# Altium project ReactionWheelPCB.PrjPcb
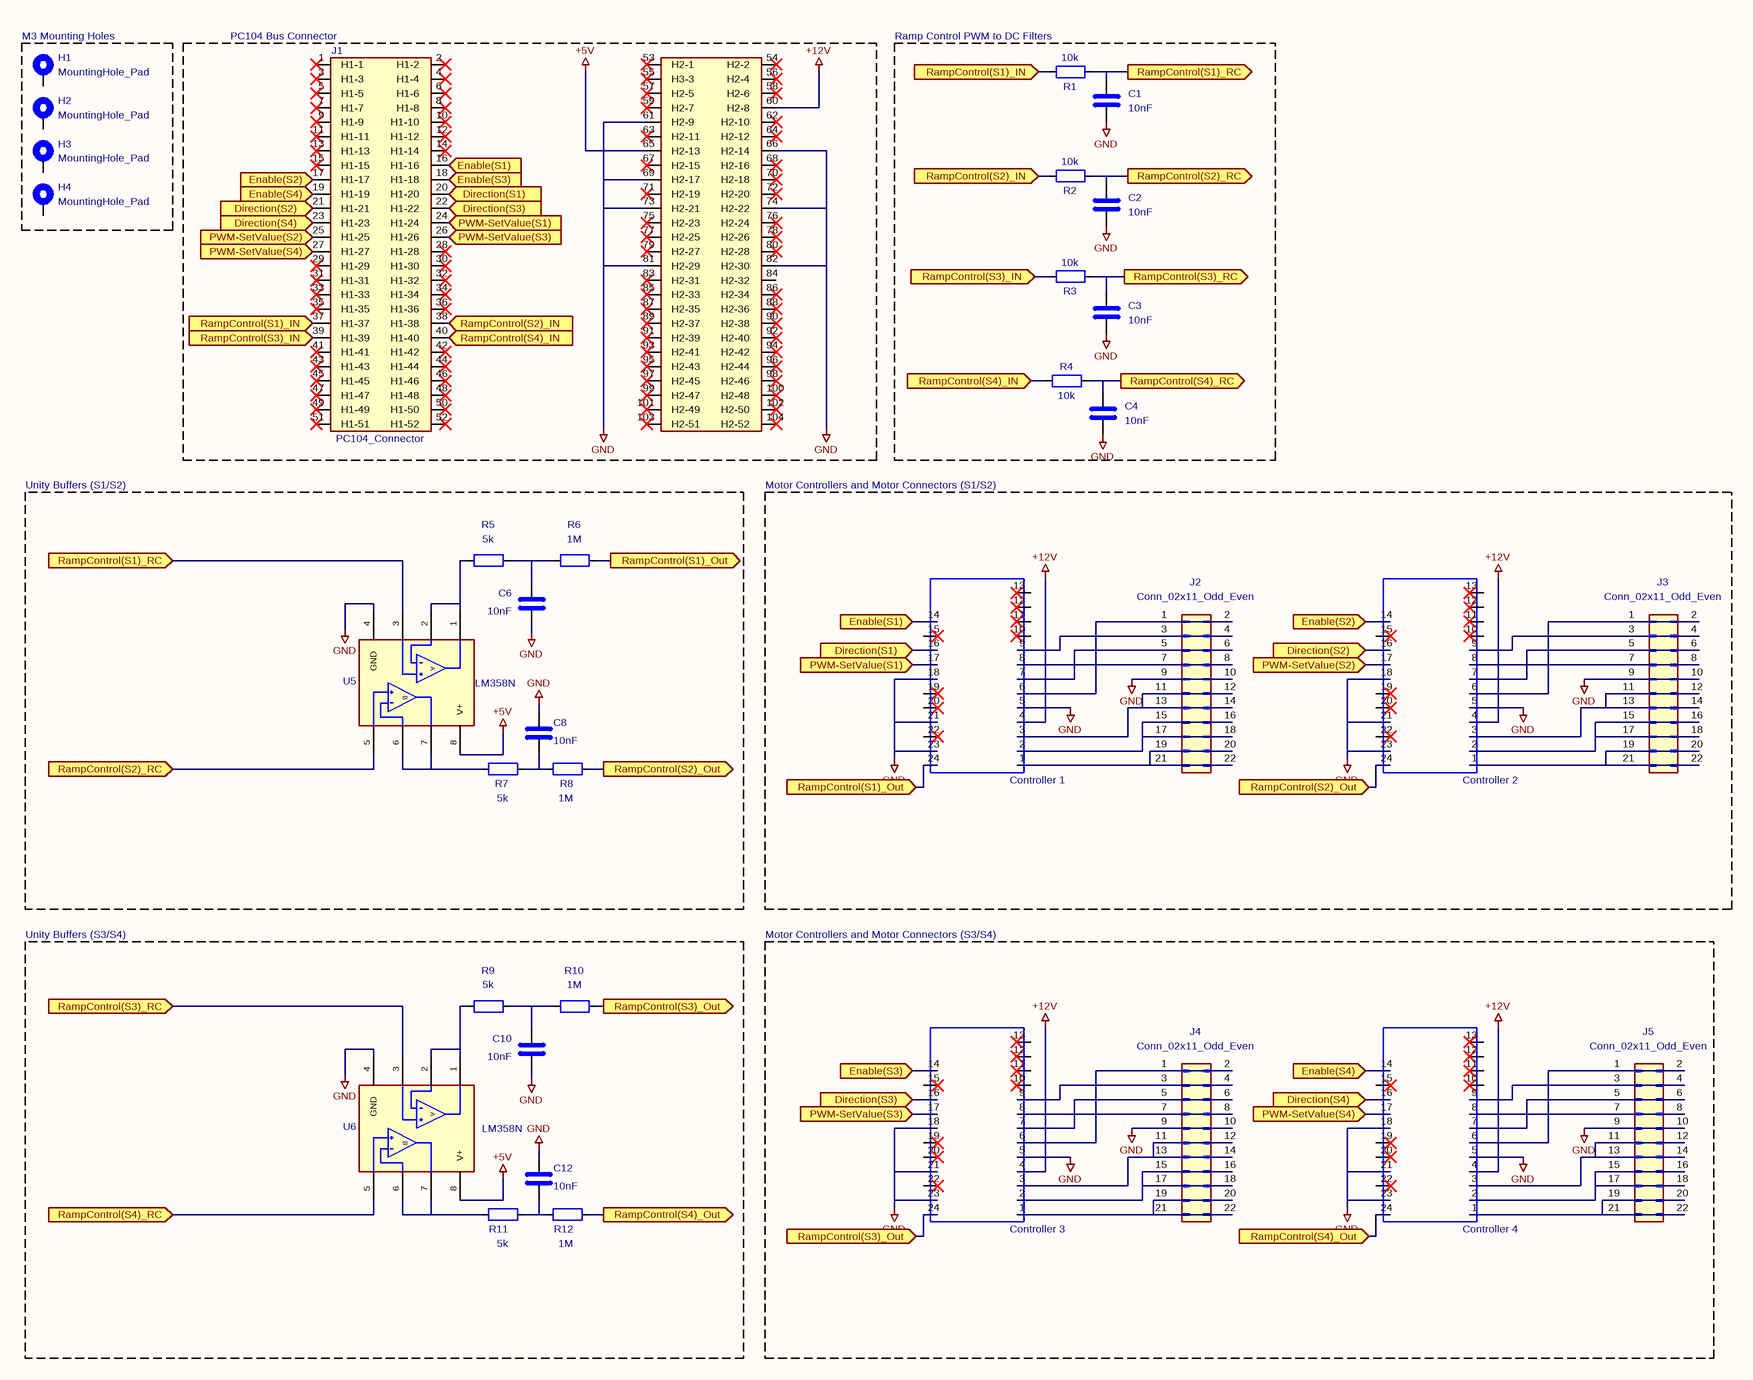
[diagram p0: ReactionWheelPCB.SchDoc]
1 sheet, 35 parts. Net scope: flat (ports and power ports of the same name join across sheets).
Board files: ReactionWheelPCB.PcbDoc, ReactionWheelPCB(1).PcbDoc

## Sheet ReactionWheelPCB.SchDoc
size 420 x 297 mm

### Parts
C1  10nF  [C_0603_1608Metric]
C2  10nF  [C_0603_1608Metric]
C3  10nF  [C_0603_1608Metric]
C4  10nF  [C_0603_1608Metric]
C6  10nF  [C_0603_1608Metric]
C8  10nF  [C_0603_1608Metric]
C10  10nF  [C_0603_1608Metric]
C12  10nF  [C_0603_1608Metric]
H1  MountingHole_Pad  [MountingHole_3.2mm_M3_Pad_TopBottom]
H2  MountingHole_Pad  [MountingHole_3.2mm_M3_Pad_TopBottom]
H3  MountingHole_Pad  [MountingHole_3.2mm_M3_Pad_TopBottom]
H4  MountingHole_Pad  [MountingHole_3.2mm_M3_Pad_TopBottom]
J1  PC104_Connector  [pc104-connector]
J2  Conn_02x11_Odd_Even  [1-1734248-1-reaction-wheel-connector]
J3  Conn_02x11_Odd_Even  [1-1734248-1-reaction-wheel-connector]
J4  Conn_02x11_Odd_Even  [1-1734248-1-reaction-wheel-connector]
J5  Conn_02x11_Odd_Even  [1-1734248-1-reaction-wheel-connector]
R1  10k  [R_0603_1608Metric]
R2  10k  [R_0603_1608Metric]
R3  10k  [R_0603_1608Metric]
R4  10k  [R_0603_1608Metric]
R5  5k  [R_0603_1608Metric]
R6  1M  [R_0603_1608Metric]
R7  5k  [R_0603_1608Metric]
R8  1M  [R_0603_1608Metric]
R9  5k  [R_0603_1608Metric]
R10  1M  [R_0603_1608Metric]
R11  5k  [R_0603_1608Metric]
R12  1M  [R_0603_1608Metric]
U1  Controller 1  [Escon24.2]
U2  Controller 2  [Escon24.2]
U3  Controller 3  [Escon24.2]
U4  Controller 4  [Escon24.2]
U5  LM358N  [DIP794W45P254L959H508Q8]
U6  LM358N  [DIP794W45P254L959H508Q8]

### Blocks framed on the sheet
M3 Mounting Holes /: H1-H4
PC104 Bus Connector: J1
Ramp Control PWM to DC Filters: C1-C4 R1-R4
Motor Controllers and Motor Connectors (S1/S2) /: J2 J3 U1 U2
Motor Controllers and Motor Connectors (S3/S4) /: J4 J5 U3 U4

### Ports
Direction(S1) (in), Direction(S2) (in), Direction(S3) (in), Direction(S4) (in), Enable(S1) (in), Enable(S2) (in), Enable(S3) (in), Enable(S4) (in), PWM-SetValue(S1) (in), PWM-SetValue(S2) (in), PWM-SetValue(S3) (in), PWM-SetValue(S4) (in), RampControl(S1)_IN (in), RampControl(S1)_Out (in), RampControl(S1)_Out (out), RampControl(S1)_RC (in), RampControl(S1)_RC (out), RampControl(S2)_IN (in), RampControl(S2)_Out (in), RampControl(S2)_Out (out), RampControl(S2)_RC (in), RampControl(S2)_RC (out), RampControl(S3)_IN (in), RampControl(S3)_Out (in), RampControl(S3)_Out (out), RampControl(S3)_RC (in), RampControl(S3)_RC (out), RampControl(S4)_IN (in), RampControl(S4)_Out (in), RampControl(S4)_Out (out), RampControl(S4)_RC (in), RampControl(S4)_RC (out)

### Nets
+5V: J1.65(H2-13) U5.8(V+) U6.8(V+)
+12V: J1.60(H2-8) U1.4 U2.4 U3.4 U4.4
GND: C1.1 C2.1 C3.1 C4.1 C6.1 C8.1 C10.1 C12.1 J1.61(H2-9) J1.66(H2-14) J1.69(H2-17) J1.73(H2-21) J1.74(H2-22) J1.81(H2-29) J1.82(H2-30) J2.9(Pin_9) J2.10(Pin_10) J3.9(Pin_9) J3.10(Pin_10) J4.9(Pin_9) J4.10(Pin_10) J5.9(Pin_9) J5.10(Pin_10) U1.5 U1.18 U1.21 U1.23 U2.5 U2.18 U2.21 U2.23 U3.5 U3.18 U3.21 U3.23 U4.5 U4.18 U4.21 U4.23 U5.4(GND) U6.4(GND)
Direction(S1): J1.20(H1-20) U1.16 ; port Direction(S1)
Direction(S2): J1.21(H1-21) U2.16 ; port Direction(S2)
Direction(S3): J1.22(H1-22) U3.16 ; port Direction(S3)
Direction(S4): J1.23(H1-23) U4.16 ; port Direction(S4)
Enable(S1): J1.16(H1-16) U1.14 ; port Enable(S1)
Enable(S2): J1.17(H1-17) U2.14 ; port Enable(S2)
Enable(S3): J1.18(H1-18) U3.14 ; port Enable(S3)
Enable(S4): J1.19(H1-19) U4.14 ; port Enable(S4)
PWM-SetValue(S1): J1.24(H1-24) U1.17 ; port PWM-SetValue(S1)
PWM-SetValue(S2): J1.25(H1-25) U2.17 ; port PWM-SetValue(S2)
PWM-SetValue(S3): J1.26(H1-26) U3.17 ; port PWM-SetValue(S3)
PWM-SetValue(S4): J1.27(H1-27) U4.17 ; port PWM-SetValue(S4)
RampControl(S1)_IN: J1.37(H1-37) R1.1 ; port RampControl(S1)_IN
RampControl(S1)_Out: R6.1 U1.24 ; port RampControl(S1)_Out
RampControl(S1)_RC: C1.2 R1.2 U5.3 ; port RampControl(S1)_RC
RampControl(S2)_IN: J1.38(H1-38) R2.1 ; port RampControl(S2)_IN
RampControl(S2)_Out: R8.2 U2.24 ; port RampControl(S2)_Out
RampControl(S2)_RC: C2.2 R2.2 U5.5 ; port RampControl(S2)_RC
RampControl(S3)_IN: J1.39(H1-39) R3.1 ; port RampControl(S3)_IN
RampControl(S3)_Out: R10.1 U3.24 ; port RampControl(S3)_Out
RampControl(S3)_RC: C3.2 R3.2 U6.3 ; port RampControl(S3)_RC
RampControl(S4)_IN: J1.40(H1-40) R4.1 ; port RampControl(S4)_IN
RampControl(S4)_Out: R12.2 U4.24 ; port RampControl(S4)_Out
RampControl(S4)_RC: C4.2 R4.2 U6.5 ; port RampControl(S4)_RC
NetC6_2: C6.2 R5.1 R6.2
NetC8_2: C8.2 R7.2 R8.1
NetC10_2: C10.2 R9.1 R10.2
NetC12_2: C12.2 R11.2 R12.1
NetJ2_1: J2.1(Pin_1) J2.2(Pin_2) U1.6
NetJ2_3: J2.3(Pin_3) J2.4(Pin_4) U1.9
NetJ2_5: J2.5(Pin_5) J2.6(Pin_6) U1.7
NetJ2_7: J2.7(Pin_7) J2.8(Pin_8) U1.8
NetJ2_11: J2.11(Pin_11) J2.12(Pin_12) J2.13(Pin_13) J2.14(Pin_14) U1.3
NetJ2_15: J2.15(Pin_15) J2.16(Pin_16) J2.17(Pin_17) J2.18(Pin_18) U1.2
NetJ2_19: J2.19(Pin_19) J2.20(Pin_20) J2.21(Pin_21) J2.22(Pin_22) U1.1
NetJ3_1: J3.1(Pin_1) J3.2(Pin_2) U2.6
NetJ3_3: J3.3(Pin_3) J3.4(Pin_4) U2.9
NetJ3_5: J3.5(Pin_5) J3.6(Pin_6) U2.7
NetJ3_7: J3.7(Pin_7) J3.8(Pin_8) U2.8
NetJ3_11: J3.11(Pin_11) J3.12(Pin_12) J3.13(Pin_13) J3.14(Pin_14) U2.3
NetJ3_15: J3.15(Pin_15) J3.16(Pin_16) J3.17(Pin_17) J3.18(Pin_18) U2.2
NetJ3_19: J3.19(Pin_19) J3.20(Pin_20) J3.21(Pin_21) J3.22(Pin_22) U2.1
NetJ4_1: J4.1(Pin_1) J4.2(Pin_2) U3.6
NetJ4_3: J4.3(Pin_3) J4.4(Pin_4) U3.9
NetJ4_5: J4.5(Pin_5) J4.6(Pin_6) U3.7
NetJ4_7: J4.7(Pin_7) J4.8(Pin_8) U3.8
NetJ4_11: J4.11(Pin_11) J4.12(Pin_12) J4.13(Pin_13) J4.14(Pin_14) U3.3
NetJ4_15: J4.15(Pin_15) J4.16(Pin_16) J4.17(Pin_17) J4.18(Pin_18) U3.2
NetJ4_19: J4.19(Pin_19) J4.20(Pin_20) J4.21(Pin_21) J4.22(Pin_22) U3.1
NetJ5_1: J5.1(Pin_1) J5.2(Pin_2) U4.6
NetJ5_3: J5.3(Pin_3) J5.4(Pin_4) U4.9
NetJ5_5: J5.5(Pin_5) J5.6(Pin_6) U4.7
NetJ5_7: J5.7(Pin_7) J5.8(Pin_8) U4.8
NetJ5_11: J5.11(Pin_11) J5.12(Pin_12) J5.13(Pin_13) J5.14(Pin_14) U4.3
NetJ5_15: J5.15(Pin_15) J5.16(Pin_16) J5.17(Pin_17) J5.18(Pin_18) U4.2
NetJ5_19: J5.19(Pin_19) J5.20(Pin_20) J5.21(Pin_21) J5.22(Pin_22) U4.1
NetR5_2: R5.2 U5.1 U5.2
NetR7_1: R7.1 U5.6 U5.7
NetR9_2: R9.2 U6.1 U6.2
NetR11_1: R11.1 U6.6 U6.7

Not connected (* = marked no-connect by the designer): H1 1; H2 1; H3 1; H4 1; J1 1(H1-1)* 2(H1-2)* 3(H1-3)* 4(H1-4)* 5(H1-5)* 6(H1-6)* 7(H1-7)* 8(H1-8)* 9(H1-9)* 10(H1-10)* 11(H1-11)* 12(H1-12)* 13(H1-13)* 14(H1-14)* 15(H1-15)* 28(H1-28)* 29(H1-29)* 30(H1-30)* 31(H1-31)* 32(H1-32)* 33(H1-33)* 34(H1-34)* 35(H1-35)* 36(H1-36)* 41(H1-41)* 42(H1-42)* 43(H1-43)* 44(H1-44)* 45(H1-45)* 46(H1-46)* 47(H1-47)* 48(H1-48)* 49(H1-49)* 50(H1-50)* 51(H1-51)* 52(H1-52)* 53(H2-1)* 54(H2-2)* 55(H3-3)* 56(H2-4)* 57(H2-5)* 58(H2-6)* 59(H2-7)* 62(H2-10)* 63(H2-11)* 64(H2-12)* 67(H2-15)* 68(H2-16)* 70(H2-18)* 71(H2-19)* 72(H2-20)* 75(H2-23)* 76(H2-24)* 77(H2-25)* 78(H2-26)* 79(H2-27)* 80(H2-28)* 83(H2-31)* 84(H2-32) 85(H2-33)* 86(H2-34)* 87(H2-35)* 88(H2-36)* 89(H2-37)* 90(H2-38)* 91(H2-39)* 92(H2-40)* 93(H2-41)* 94(H2-42)* 95(H2-43)* 96(H2-44)* 97(H2-45)* 98(H2-46)* 99(H2-47)* 100(H2-48)* 101(H2-49)* 102(H2-50)* 103(H2-51)* 104(H2-52)*; U1 10* 11* 12* 13* 15* 19* 20* 22*; U2 10* 11* 12* 13* 15* 19* 20* 22*; U3 10* 11* 12* 13* 15* 19* 20* 22*; U4 10* 11* 12* 13* 15* 19* 20* 22*

### Notes on the sheet
- Unity Buffers (S1/S2)
- Unity Buffers (S3/S4)
- 1
- 2
- 3
- 4
- 5
- 6
- 7
- 8
- A
- B
- C
- D
- E
- Title:
- File: ReactionWheelPCB.kicad_sch
- Sheet: /
- F
- KiCad E.D.A.  kicad (5.1.4)-1
- Size: A3
- Date:
- Rev:
- Id: 1/1
- (in symbol LM358) A; B

### Library data of the parts
C1-C4 C6 C8 C10 C12 = C: Value: 10nF; Footprint: Capacitor_SMD:C_0603_1608Metric
R1-R12 = R: Footprint: Resistor_SMD:R_0603_1608Metric
  R1-R4: Value: 10k
  R5 R7 R9 R11: Value: 5k
  R6 R8 R10 R12: Value: 1M
U1-U4 = Escon24.2-symbols-Controller_Board-rescue-UpdatedController-rescue: Footprint: qset-footprints:Escon24.2
  U1: Value: Controller 1
  U2: Value: Controller 2
  U3: Value: Controller 3
  U4: Value: Controller 4
U5 U6 = LM358: Value: LM358N; Footprint: qset-footprints:DIP794W45P254L959H508Q8
H1-H4 = MountingHole_Pad: Value: MountingHole_Pad; Footprint: MountingHole:MountingHole_3.2mm_M3_Pad_TopBottom
J1 = PC104_Connector: Value: PC104_Connector; Footprint: qset-footprints:pc104-connector
J2-J5 = Conn_02x11_Odd_Even: Value: Conn_02x11_Odd_Even; Footprint: qset-footprints:1-1734248-1-reaction-wheel-connector